# Altium schematic sheet remora-2.SchDoc
size A
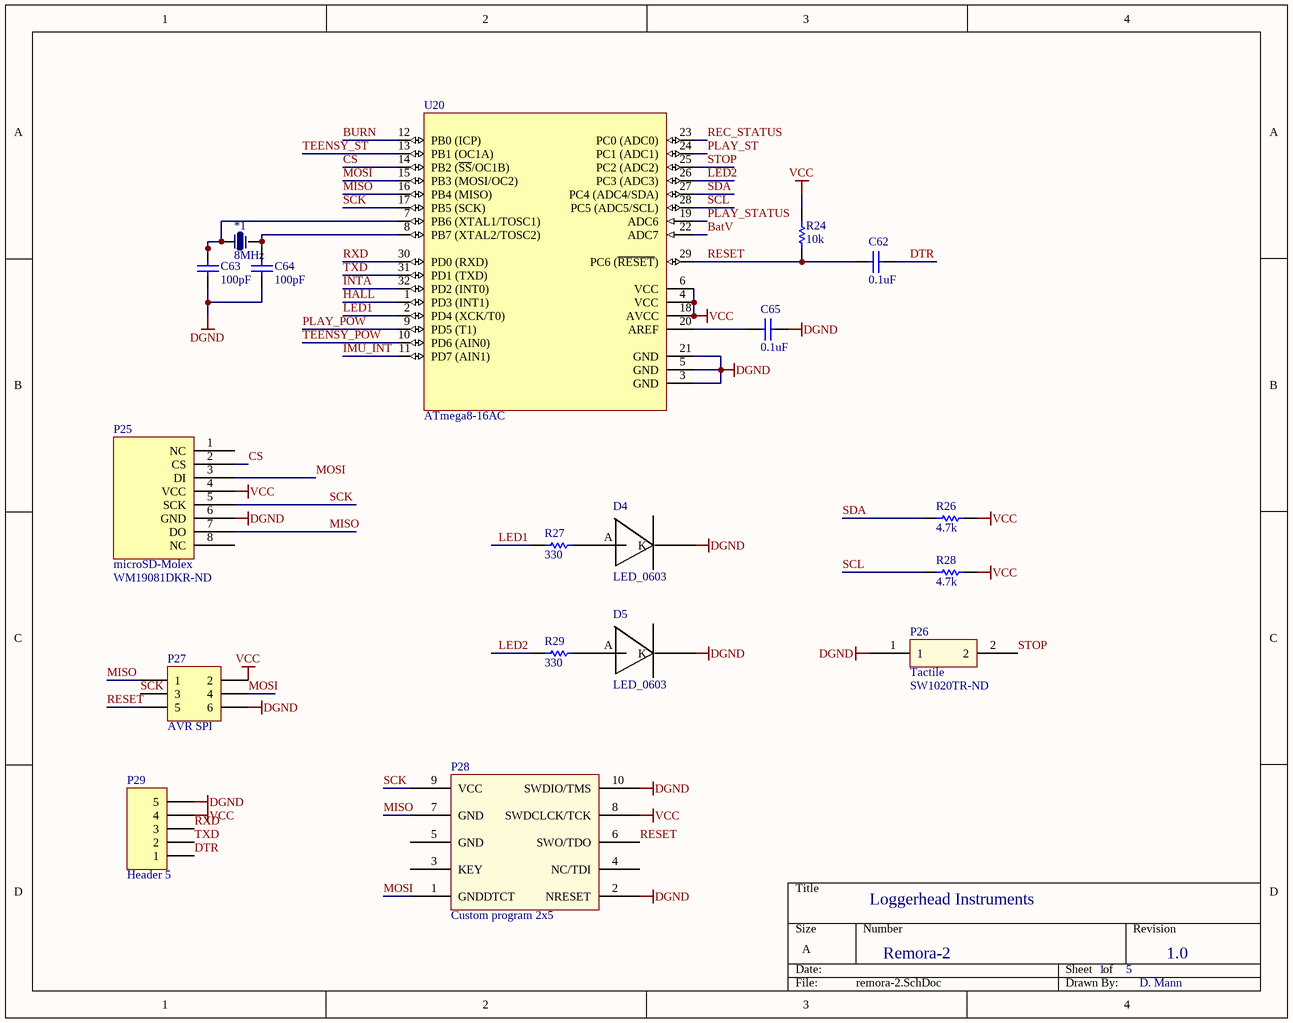
[diagram p0: remora-2.SchDoc]

## Parts
*1  8MHz  [XTAL-ABM3]
C62  0.1uF  [0402]
C63  100pF  [0402]
C64  100pF  [0402]
C65  0.1uF  [0402]
D4  LED_0603  [Diode0603]
D5  LED_0603  [Diode0603]
P25  microSD-Molex  Supplier Part Number 1: WM19081DKR-ND  [microSD_Molex_hinged]
P26  Tactile  Supplier Part Number 1: SW1020TR-ND  [Tactile-B3U-1000]
P27  AVR SPI  [HDR2X3]
P28  Custom program 2x5  [Header_2x5_50mil]
P29  Header 5  [HDR1X5]
R24  10k  [3-0603]
R26  4.7k  [3-0603]
R27  330  [3-0603]
R28  4.7k  [3-0603]
R29  330  [3-0603]
U20  ATmega8-16AC  [32M1-A_M]

## Nets
DGND: C63.1 C64.1 C65.2 D4.K D5.K P25.6(GND) P26.1 P27.6 P28.2(NRESET) P28.10(SWDIO/TMS) P29.5 U20.3(GND) U20.5(GND) U20.21(GND)
VCC: P25.4(VCC) P27.2 P28.8(SWDCLCK/TCK) P29.4 R24.2 R26.2 R28.2 U20.4(VCC) U20.6(VCC) U20.18(AVCC)
BatV: U20.22(ADC7)
BURN: U20.12(PB0_(ICP))
CS: P25.2(CS) U20.14(PB2_(~{SS}/OC1B))
DTR: C62.2 P29.1
HALL: U20.1(PD3_(INT1))
IMU_INT: U20.11(PD7_(AIN1))
INTA: U20.32(PD2_(INT0))
LED1: R27.1 U20.2(PD4_(XCK/T0))
LED2: R29.1 U20.26(PC3_(ADC3))
MISO: P25.7(DO) P27.1 P28.7(GND) U20.16(PB4_(MISO))
MOSI: P25.3(DI) P27.4 P28.1(GNDDTCT) U20.15(PB3_(MOSI/OC2))
PLAY_POW: U20.9(PD5_(T1))
PLAY_ST: U20.24(PC1_(ADC1))
PLAY_STATUS: U20.19(ADC6)
REC_STATUS: U20.23(PC0_(ADC0))
RESET: C62.1 P27.5 P28.6(SWO/TDO) R24.1 U20.29(PC6_(~{RESET}))
RXD: P29.3 U20.30(PD0_(RXD))
SCK: P25.5(SCK) P27.3 P28.9(VCC) U20.17(PB5_(SCK))
SCL: R28.1 U20.28(PC5_(ADC5/SCL))
SDA: R26.1 U20.27(PC4_(ADC4/SDA))
STOP: P26.2 U20.25(PC2_(ADC2))
TEENSY_POW: U20.10(PD6_(AIN0))
TEENSY_ST: U20.13(PB1_(OC1A))
TXD: P29.2 U20.31(PD1_(TXD))
Net*1_1: *1.1 C63.2 U20.7(PB6_(XTAL1/TOSC1))
Net*1_2: *1.2 C64.2 U20.8(PB7_(XTAL2/TOSC2))
NetC65_1: C65.1 U20.20(AREF)
NetD4_A: D4.A R27.2
NetD5_A: D5.A R29.2

Not connected (* = marked no-connect by the designer): P25 1(NC) 8(NC); P28 3(KEY) 4(NC/TDI) 5(GND)

## Notes on the sheet
- Loggerhead Instruments
- Remora-2
- 1
- 5
- 1.0
- D. Mann

## Library data of the parts
*1 = XTAL-ABM3
C62-C65 = C0402: Ceramic Chip Capacitor - Standard; Note: Footprint corresponds to dimensions for bulk cassette packaging. This case size has tightened tolerances.; Published: 17-Jul-2002; LatestRevisionDate: 19-Mar-2004; LatestRevisionNote: Silkscreen size reduced.; DatasheetDocument: Mar-2001; PackageDocument: Mar-2001; PackageReference: 0402; Publisher: Altium Limited; Code_JEITA: 0402; Code_IPC: 1005 [0402]; ComponentLink1Description: Manufacturer Link; ComponentLink1URL: http://www.kemet.com/; ComponentLink2Description: Datasheet; ComponentLink2URL: http://www.kemet.com/kemet/web/homepage/kechome.nsf/vapubfilesname/F3102TA.pdf/$file/F3102TA.pdf
  C62 C65: Value: 0.1uF
  C63 C64: Value: 100pF
P25 = microSD_Molex_hinged: Supplier 1: Digi-Key
P26 = Tactile_B3U-1000: Supplier 1: Digi-Key
P27 = Header 3X2: Header, 3-Pin, Dual row; LatestRevisionDate: 17-Jul-2002; LatestRevisionNote: Re-released for DXP Platform.; Publisher: Altium Limited
P28 = CortexDebug
P29 = Header 5: Header, 5-Pin; LatestRevisionDate: 17-Jul-2002; LatestRevisionNote: Re-released for DXP Platform.; Publisher: Altium Limited
R24 R26-R29 = ERJ3RK: Precision Thick Film Chip Resistor, 10 Ohm to 1M Ohm Range, 1% and 0.5% Tolerance, 0603 Size, 0.063 W; Published: 17-Dec-2003; LatestRevisionDate: 19-Mar-2004; LatestRevisionNote: Silkscreen size reduced.; PackageDocument: Mar-2003; PackageReference: 3-0603; Publisher: Altium Limited; Code_IPC: 1608 [0603]; ComponentLink1Description: Manufacturer Link; ComponentLink1URL: http://www.panasonic.com/industrial/components/resistive_products.htm; ComponentLink2Description: Datasheet; ComponentLink2URL: http://www.panasonic.com/industrial/components/pdf/AOA0000CE2.pdf
U20 = ATmega8-16AC: 8-Bit AVR Microcontroller with 8K Bytes of In-System Programmable Flash Memory; Published: 17-Sep-2003; LatestRevisionDate: 13-Apr-2006; LatestRevisionNote: IPC-7351 Footprint Added.; DatasheetVersion: 2486H-AVR-09/02; PackageVersion: revB, Oct-2001; PackageReference: 32A; Publisher: Altium Limited; PackageDescription: 32-Pin Thin Quad Flat Pack 0.8 mm Pitch; Code_JEDEC: MS-026-ABA; ComponentLink1Description: Manufacturer Link; ComponentLink1URL: http://www.atmel.com; ComponentLink2Description: Datasheet; ComponentLink2URL: http://www.atmel.com/dyn/resources/prod_documents/doc2486.pdf